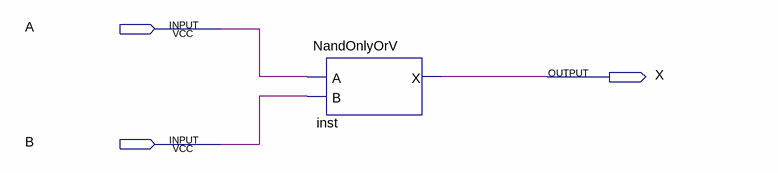
[diagram p0: schematic sheet]
// Quartus schematic NandOnlyOr.bdf as structural Verilog: 1 symbols, 3 pins
module NandOnlyOr (
  input  A,
  input  B,
  output X
);

  NandOnlyOrV inst (.A(A), .B(B), .X(X));
endmodule
